# Altium schematic sheet P450_FJ_P_A_V2.3_F.SchDoc
size 508 x 304 mm
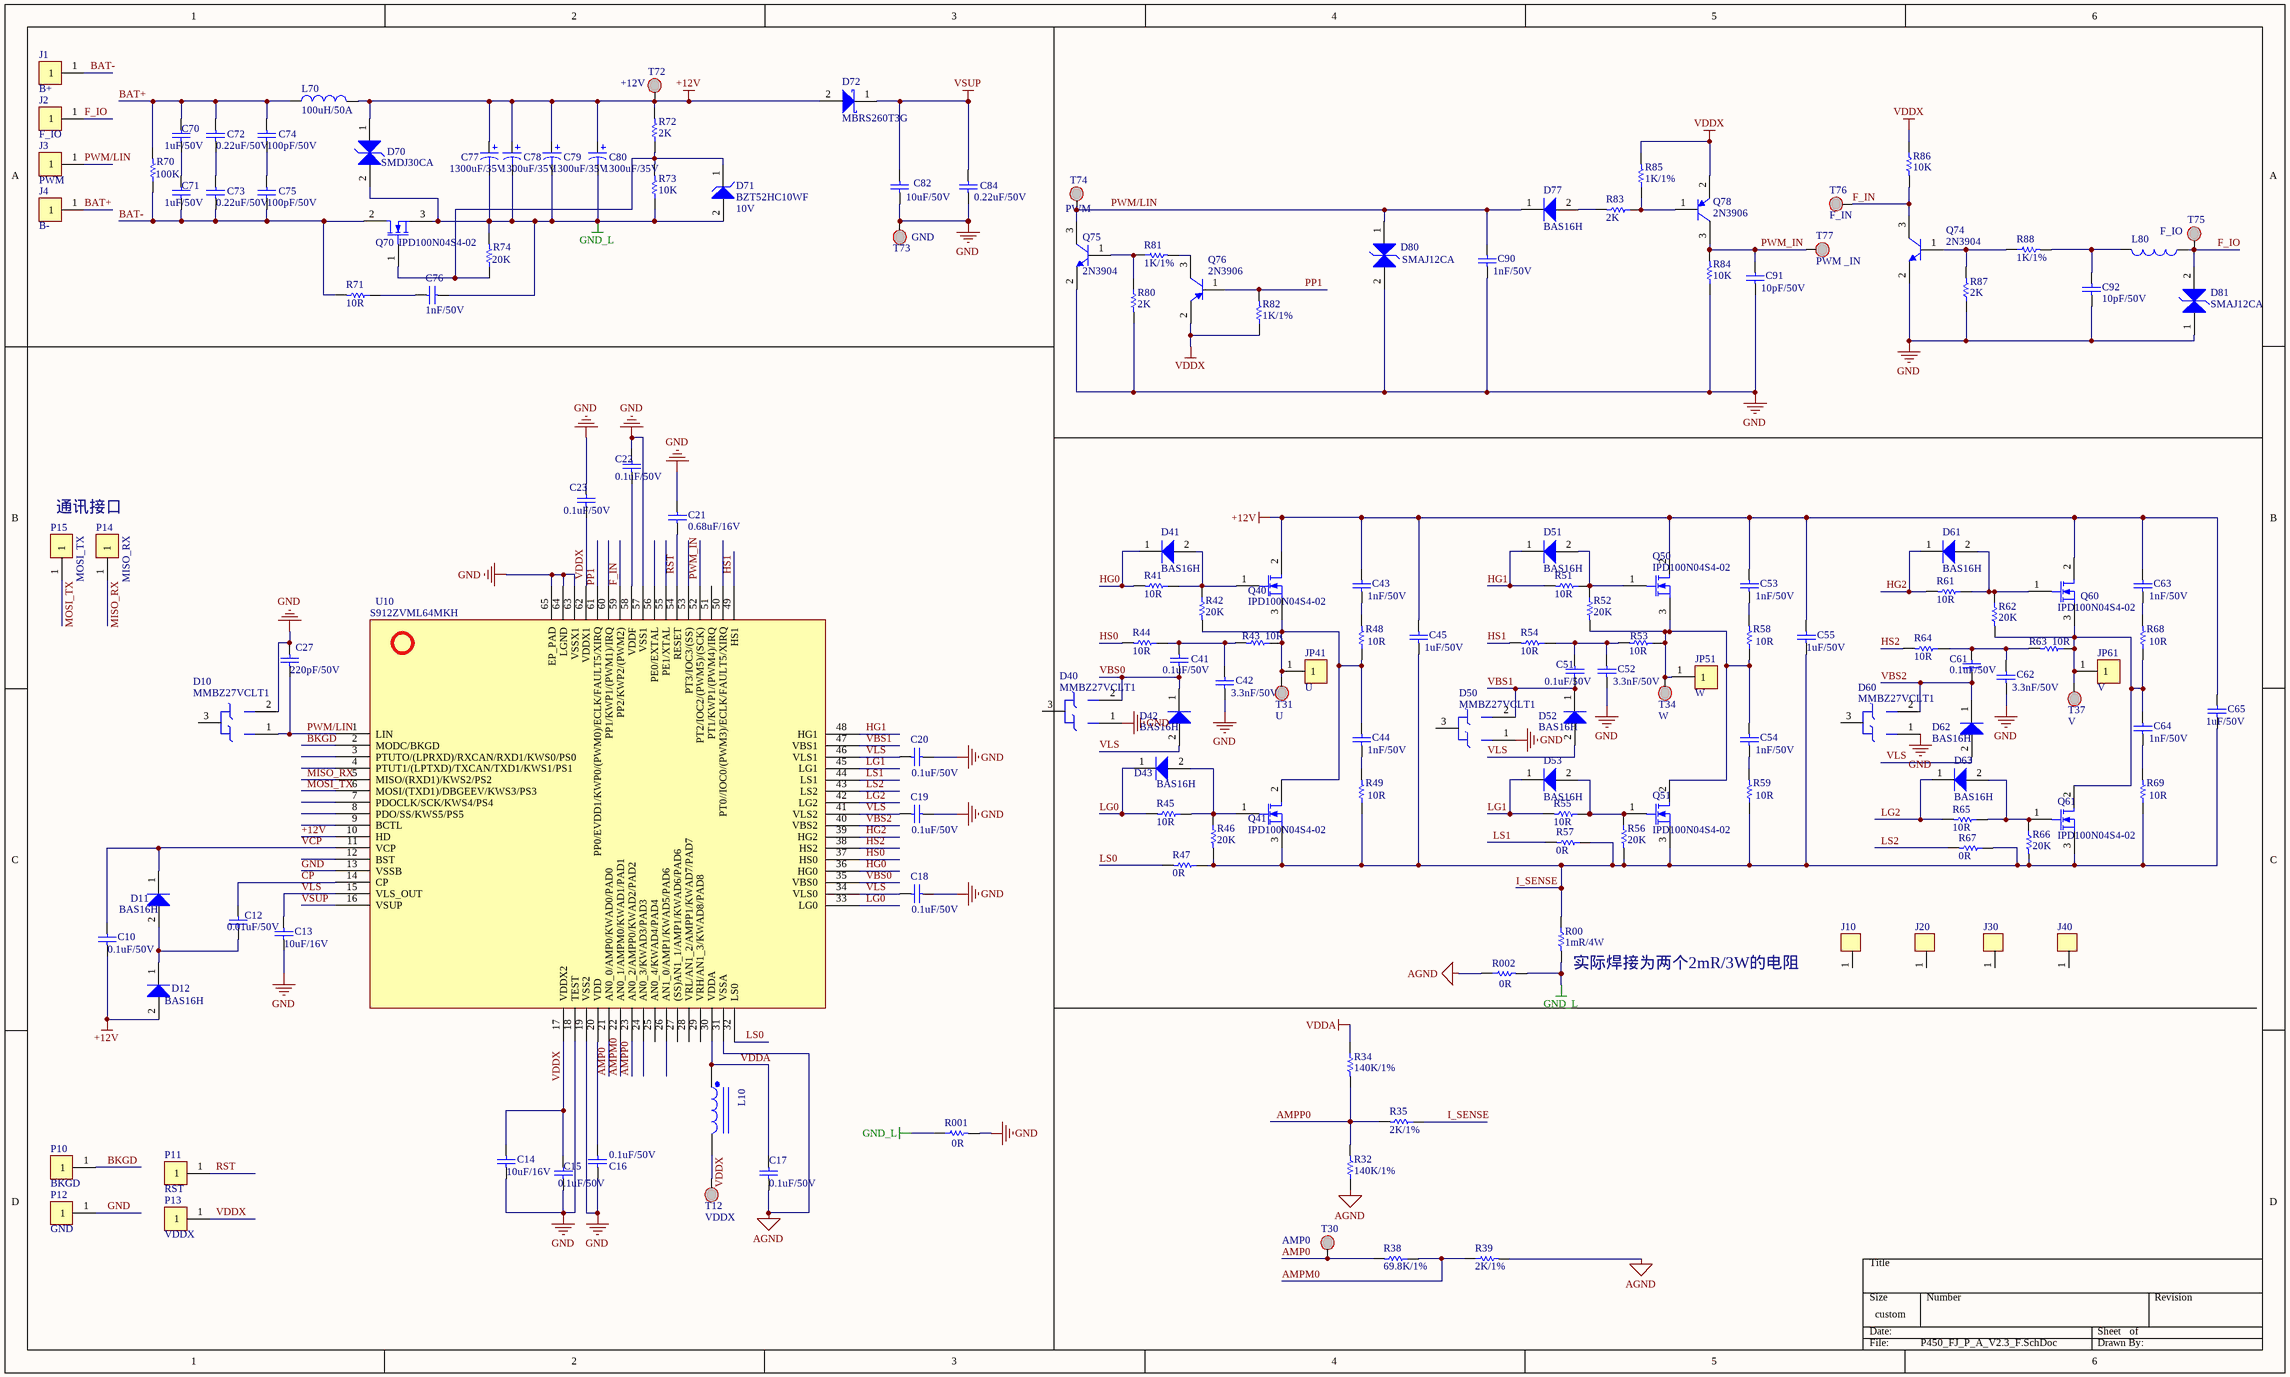
[diagram p0: P450_FJ_P_A_V2.3_F.SchDoc]

## Parts
C10  0.1uF/50V  [0603]
C12  0.01uF/50V  [0603]
C13  10uF/16V  [0805]
C14  10uF/16V  [0805]
C15  0.1uF/50V  [0603]
C16  0.1uF/50V  [0603]
C17  0.1uF/50V  [0603]
C18  0.1uF/50V  [0603]
C19  0.1uF/50V  [0603]
C20  0.1uF/50V  [0603]
C21  0.68uF/16V  [0603]
C22  0.1uF/50V  [0603]
C23  0.1uF/50V  [0603]
C27  220pF/50V  [0603]
C41  0.1uF/50V  [0603]
C42  3.3nF/50V  [0603]
C43  1nF/50V  [0603]
C44  1nF/50V  [0603]
C45  1uF/50V  [0805]
C51  0.1uF/50V  [0603]
C52  3.3nF/50V  [0603]
C53  1nF/50V  [0603]
C54  1nF/50V  [0603]
C55  1uF/50V  [0805]
C61  0.1uF/50V  [0603]
C62  3.3nF/50V  [0603]
C63  1nF/50V  [0603]
C64  1nF/50V  [0603]
C65  1uF/50V  [0805]
C70  1uF/50V  [0805]
C71  1uF/50V  [0805]
C72  0.22uF/50V  [0805]
C73  0.22uF/50V  [0805]
C74  100pF/50V  [0805]
C75  100pF/50V  [0805]
C76  1nF/50V  [0603]
C77  value 1300uF/35V  [RB5.0]  (hidden comment: EGPD350E__132MK20H)
C78  value 1300uF/35V  [RB5.0]  (hidden comment: EGPD350E__132MK20H)
C79  value 1300uF/35V  [RB5.0]  (hidden comment: EGPD350E__132MK20H)
C80  value 1300uF/35V  [RB5.0]  (hidden comment: EGPD350E__132MK20H)
C82  10uF/50V  [1210]
C84  0.22uF/50V  [0805]
C90  1nF/50V  [0603]
C91  10pF/50V  [0603]
C92  10pF/50V  [0603]
D10  MMBZ27VCLT1  [SOT-23T]
D11  BAS16H  [SOD323]
D12  BAS16H  [SOD323]
D40  MMBZ27VCLT1  [SOT-23T]
D41  BAS16H  [SOD323]
D42  BAS16H  [SOD323]
D43  BAS16H  [SOD323]
D50  MMBZ27VCLT1  [SOT-23T]
D51  BAS16H  [SOD323]
D52  BAS16H  [SOD323]
D53  BAS16H  [SOD323]
D60  MMBZ27VCLT1  [SOT-23T]
D61  BAS16H  [SOD323]
D62  BAS16H  [SOD323]
D63  BAS16H  [SOD323]
D70  SMDJ30CA  [DO-214AB]
D71  BZT52HC10WF  [SOD123]
D72  MBRS260T3G  [SMB403A-03]
D77  BAS16H  [SOD323]
D80  SMAJ12CA  [SMA/DO-214AC]
D81  SMAJ12CA  [SMA/DO-214AC]
J1  B+  [POWER]
J2  F_IO  [IO]
J3  PWM  [IO]
J4  B-  [POWER]
J10  M3  [PADS]  (value not drawn)
J20  M3  [PADS]  (value not drawn)
J30  M3  [PADS]  (value not drawn)
J40  M3  [PADS]  (value not drawn)
JP41  U  [UVW1]
JP51  W  [UVW1]
JP61  V  [UVW1]
L10  KMZ1608YHR102BTD  [0603]  (value not drawn)
L70  100uH/50A  [L10-20]
L80  KMZ1608YHR102BTD  [0603]  (value not drawn)
P10  BKGD  [TEST_S1]
P11  RST  [TEST_S1]
P12  GND  [TEST_S1]
P13  VDDX  [TEST_S2]
P14  MISO_RX  [TEST_S1]
P15  MOSI_TX  [TEST_S1]
Q40  IPD100N04S4-02  [TO-252]
Q41  IPD100N04S4-02  [TO-252]
Q50  IPD100N04S4-02  [TO-252]
Q51  IPD100N04S4-02  [TO-252]
Q60  IPD100N04S4-02  [TO-252]
Q61  IPD100N04S4-02  [TO-252]
Q70  IPD100N04S4-02  [TO-252]
Q74  2N3904  [SOT-23T]
Q75  2N3904  [SOT-23T]
Q76  2N3906  [SOT-23T]
Q78  2N3906  [SOT-23T]
R00  value 1mR/4W  [1050]  (hidden comment: LRS1050FEDHR001)
R001  0R  [0603]
R002  0R  [0603]
R32  140K/1%  [0603]
R34  140K/1%  [0603]
R35  2K/1%  [0603]
R38  69.8K/1%  [0603]
R39  2K/1%  [0603]
R41  10R  [0603]
R42  20K  [0603]
R43  10R  [0603]
R44  10R  [0603]
R45  10R  [0603]
R46  20K  [0603]
R47  0R  [0603]
R48  10R  [0603]
R49  10R  [0603]
R51  10R  [0603]
R52  20K  [0603]
R53  10R  [0603]
R54  10R  [0603]
R55  10R  [0603]
R56  20K  [0603]
R57  0R  [0603]
R58  10R  [0603]
R59  10R  [0603]
R61  10R  [0603]
R62  20K  [0603]
R63  10R  [0603]
R64  10R  [0603]
R65  10R  [0603]
R66  20K  [0603]
R67  0R  [0603]
R68  10R  [0603]
R69  10R  [0603]
R70  100K  [0805]
R71  10R  [0603]
R72  2K  [0603]
R73  10K  [0603]
R74  20K  [0603]
R80  2K  [0603]
R81  1K/1%  [0603]
R82  1K/1%  [0603]
R83  2K  [0603]
R84  10K  [0603]
R85  1K/1%  [0603]
R86  10K  [0603]
R87  2K  [0603]
R88  1K/1%  [0603]
T12  VDDX  [TEST_S]
T30  AMP0  [TEST-1]
T31  U  [TEST_S]
T34  W  [TEST_S]
T37  V  [TEST_S]
T72  +12V  [TEST_S]
T73  GND  [TEST_S]
T74  PWM  [TEST_S]
T75  F_IO  [TEST_S]
T76  F_IN  [TEST-1]
T77  PWM _IN  [TEST-1]
U10  S912ZVML64MKH  [64LQFP]

## Nets
+12V: C10.2 C43.2 C45.2 C53.2 C55.2 C63.2 C65.2 C77.1 C78.1 C79.1 C80.1 D12.2(A) D70.1 D72.2(A) L70.2 Q40.2(D) Q50.2(D) Q60.2(D) R72.2 T72.1 U10.10(HD)
AGND: C17.2 R002.1 R32.1 R39.2 U10.31(VSSA)
GND: C13.2 C14.2 C15.2 C16.1 C18.1 C19.1 C20.1 C21.2 C22.2 C23.1 C27.2 C42.1 C52.1 C62.1 C82.1 C84.1 C90.1 C91.2 C92.2 D10.2 D40.1 D50.1 D60.1 D80.2 D81.1 P12.1 Q74.2(E) Q75.2(E) R001.2 R80.2 R84.1 R87.1 T73.1 U10.13(VSSB) U10.18(TEST) U10.19(VSS2) U10.57(VSS1) U10.63(VSSX1) U10.64(LGND) U10.65(EP_PAD)
GND_L: C76.1 C77.2 C78.2 C79.2 C80.2 D70.2 D71.2(K) Q70.3(S) R00.2 R001.1 R002.2 R73.1 R74.2
VDDA: C17.1 L10.1 R34.1 U10.30(VDDA)
VDDX: C14.1 C15.1 C23.2 L10.2 P13.1 Q76.2(E) Q78.2(E) R82.1 R85.2 R86.1 T12.1 U10.17(VDDX2) U10.62(VDDX1)
VSUP: C82.2 C84.2 D72.1(C) U10.16(VSUP)
AMP0: R38.2 T30.1 U10.21(AN0_0/AMP0/KWAD0/PAD0)
AMPM0: R38.1 R39.1 U10.22(AN0_1/AMPM0/KWAD1/PAD1)
AMPP0: R32.2 R34.2 R35.2 U10.23(AN0_2/AMPP0/KWAD2/PAD2)
BAT+: C70.2 C72.2 C74.2 J4.1 L70.1 R70.2
BAT-: C71.1 C73.1 C75.1 J1.1 Q70.2(D) R70.1 R71.2
BKGD: P10.1 U10.2(MODC/BKGD)
CP: C12.2 U10.14(CP)
F_IN: Q74.3(C) R86.2 T76.1 U10.59(PP2/KWP2/(PWM2))
F_IO: D81.2 J2.1 L80.1 T75.1
HG0: D41.1(C) R41.2 U10.36(HG0)
HG1: D51.1(C) R51.2 U10.48(HG1)
HG2: D61.1(C) R61.2 U10.39(HG2)
HS0: R44.2 U10.37(HS0)
HS1: R54.2 U10.49(HS1)
HS2: R64.2 U10.38(HS2)
I_SENSE: C45.1 C55.1 C65.1 Q41.3(S) Q51.3(S) Q61.3(S) R00.1 R35.1 R46.2 R47.1 R49.1 R56.2 R57.1 R59.1 R66.2 R67.1 R69.1
LG0: D43.1(C) R45.2 U10.33(LG0)
LG1: D53.1(C) R55.2 U10.45(LG1)
LG2: D63.1(C) R65.2 U10.42(LG2)
LS0: R47.2 U10.32(LS0)
LS1: R57.2 U10.44(LS1)
LS2: R67.2 U10.43(LS2)
MISO_RX: P14.1 U10.5(MISO/(RXD1)/KWS2/PS2)
MOSI_TX: P15.1 U10.6(MOSI/(TXD1)/DBGEEV/KWS3/PS3)
PP1: Q76.1(B) R82.2 U10.61(PP0/EVDD1/KWP0/(PWM0)/ECLK/FAULT5/XIRQ)
PWM/LIN: C27.1 C90.2 D10.1 D77.1(C) D80.1 J3.1 Q75.3(C) T74.1 U10.1(LIN)
PWM_IN: C91.1 Q78.3(C) R84.2 T77.1 U10.52(PT2/IOC2/(PWM5)/(SCK))
RST: C21.1 P11.1 U10.54(RESET)
VBS0: C41.1 D40.2 D42.1(C) U10.35(VBS0)
VBS1: C51.1 D50.2 D52.1(C) U10.47(VBS1)
VBS2: C61.1 D60.2 D62.1(C) U10.40(VBS2)
VCP: C10.1 D11.1(C) U10.11(VCP)
VLS: C13.1 C18.2 C19.2 C20.2 D42.2(A) D52.2(A) D62.2(A) U10.15(VLS_OUT) U10.34(VLS0) U10.41(VLS2) U10.46(VLS1)
NetC12_1: C12.1 D11.2(A) D12.1(C)
NetC16_2: C16.2 U10.20(VDD)
NetC22_1: C22.1 U10.58(VDDF)
NetC41_2: C41.2 C42.2 R43.2 R44.1
NetC43_1: C43.1 R48.2
NetC44_1: C44.1 R49.2
NetC44_2: C44.2 JP41.1 Q40.3(S) Q41.2(D) R42.2 R43.1 R48.1 T31.1
NetC51_2: C51.2 C52.2 R53.2 R54.1
NetC53_1: C53.1 R58.2
NetC54_1: C54.1 R59.2
NetC54_2: C54.2 JP51.1 Q50.3(S) Q51.2(D) R52.2 R53.1 R58.1 T34.1
NetC61_2: C61.2 C62.2 R63.2 R64.1
NetC63_1: C63.1 R68.2
NetC64_1: C64.1 R69.2
NetC64_2: C64.2 JP61.1 Q60.3(S) Q61.2(D) R62.2 R63.1 R68.1 T37.1
NetC70_1: C70.1 C71.2
NetC72_1: C72.1 C73.2
NetC74_1: C74.1 C75.2
NetC76_2: C76.2 R71.1
NetC92_1: C92.1 L80.2 R88.2
NetD41_2: D41.2(A) Q40.1(G) R41.1 R42.1
NetD43_2: D43.2(A) Q41.1(G) R45.1 R46.1
NetD51_2: D51.2(A) Q50.1(G) R51.1 R52.1
NetD53_2: D53.2(A) Q51.1(G) R55.1 R56.1
NetD61_2: D61.2(A) Q60.1(G) R61.1 R62.1
NetD63_2: D63.2(A) Q61.1(G) R65.1 R66.1
NetD71_1: D71.1(A) Q70.1(G) R72.1 R73.2 R74.1
NetD77_2: D77.2(A) R83.2
NetQ74_1: Q74.1(B) R87.2 R88.1
NetQ75_1: Q75.1(B) R80.1 R81.1
NetQ76_3: Q76.3(C) R81.2
NetQ78_1: Q78.1(B) R83.1 R85.1

Not connected (* = marked no-connect by the designer): D10 3; D40 3; D50 3; D60 3; J10 1; J20 1; J30 1; J40 1; U10 3(PTUTO/(LPRXD)/RXCAN/RXD1/KWS0/PS0) 4(PTUT1/(LPTXD)/TXCAN/TXD1/KWS1/PS1) 7(PDOCLK/SCK/KWS4/PS4) 8(PDO/SS/KWS5/PS5) 9(BCTL) 12(BST) 24(AN0_3/KWAD3/PAD3) 25(AN0_4/KWAD4/PAD4) 26(AN1_0/AMP1/KWAD5/PAD6) 27((SS)AN1_1/AMP1/KWAD6/PAD6) 28(VRL/AN1_2/AMPP1/KWAD7/PAD7) 29(VRH/AN1_3/KWAD8/PAD8) 50(PT0//IOC0/(PWM3)/ECLK/FAULT5/XIRQ) 51(PT1/KWP1/(PWM4)/IRQ) 53(PT3/IOC3/(SS)) 55(PE1/XTAL) 56(PE0/EXTAL) 60(PP1/KWP1/(PWM1)/IRQ)

## Notes on the sheet
- 通讯接口
- (near R00) 实际焊接为两个2mR/3W的电阻
- (in symbol D Zener) 10V

## Library data of the parts
C10 C12-C23 C27 C41-C45 C51-C55 C61-C65 C70-C76 C82 C84 C90-C92 = Cap: Capacitor; Published: 8-Jun-2000; LatestRevisionDate: 17-Jul-2002; LatestRevisionNote: Re-released for DXP Platform.; PackageReference: RAD-0.3; Publisher: Altium Limited
  C10 C15-C20 C22 C23 C41 C51 C61: PackageDescription: Radial Cap, Thru-Hole; 2 Leads; 0.3 in Pin Spacing; Value: 0.1uF/50V
  C12: PackageDescription: Radial Cap, Thru-Hole; 2 Leads; 0.3 in Pin Spacing; Value: 0.01uF/50V
  C13 C14: PackageDescription: Radial Cap, Thru-Hole; 2 Leads; 0.3 in Pin Spacing; Value: 10uF/16V
  C21: PackageDescription: Radial Cap, Thru-Hole; 2 Leads; 0.3 in Pin Spacing; Value: 0.68uF/16V
  C27: PackageDescription: Radial Cap, Thru-Hole; 2 Leads; 0.3 in Pin Spacing; Value: 220pF/50V
  C42 C52 C62: PackageDescription: Radial Cap, Thru-Hole; 2 Leads; 0.3 in Pin Spacing; Value: 3.3nF/50V
  C43 C44 C53 C54 C63 C64 C90: Value: 1nF/50V
  C45 C55 C65 C70 C71: PackageDescription: Radial Cap, Thru-Hole; 2 Leads; 0.3 in Pin Spacing; Value: 1uF/50V
  C72 C73 C84: PackageDescription: Radial Cap, Thru-Hole; 2 Leads; 0.3 in Pin Spacing; Value: 0.22uF/50V
  C74 C75: PackageDescription: Radial Cap, Thru-Hole; 2 Leads; 0.3 in Pin Spacing; Value: 100pF/50V
  C76: PackageDescription: Radial Cap, Thru-Hole; 2 Leads; 0.3 in Pin Spacing; Value: 1nF/50V
  C82: PackageDescription: Radial Cap, Thru-Hole; 2 Leads; 0.3 in Pin Spacing; Value: 10uF/50V
  C91: Value: 10pF/50V
  C92: PackageDescription: Radial Cap, Thru-Hole; 2 Leads; 0.3 in Pin Spacing; Value: 10pF/50V
C77-C80 = Cap Pol1: Published: 8-Jun-2000; LatestRevisionDate: 17-Jul-2002; LatestRevisionNote: Re-released for DXP Platform.; PackageReference: RB7.6-15; Publisher: Altium Limited; PackageDescription: Polarized Capacitor (Radial); 2 Leads
D10 D40 D50 D60 = MMBZ27VCLT1: D_TVS
D11 D12 D41-D43 D51-D53 D61-D63 D77 = Diode: Default Diode; Published: 8-Jun-2000; LatestRevisionDate: 17-Jul-2002; LatestRevisionNote: Re-released for DXP Platform.; PackageVersion: Sep-1996; PackageReference: SMC; Publisher: Altium Limited; PackageDescription: DO-214-AB/SMC; 2 C-Bend Leads; Body 7.9 x 5.9 mm, inc. leads (LxW); Code_JEDEC: DO-214-AB
D70 D80 D81 = TVS_D: Tunnel Diode - RLC Model; Published: 8-Jun-2000; LatestRevisionDate: 17-Jul-2002; LatestRevisionNote: Re-released for DXP Platform.; PackageVersion: Feb-2002; PackageReference: 3.2X1.6X1.1; Publisher: Altium Limited; PackageDescription: SM LED; 2 Flat Leads
D71 = D Zener: Zener Diode; Published: 8-Jun-2000; LatestRevisionDate: 17-Jul-2002; LatestRevisionNote: Re-released for DXP Platform.; PackageReference: DIODE-0.7; Publisher: Altium Limited; PackageDescription: Diode, Thru-Hole; 2 Leads; 0.7 in Pin Spacing
D72 = Diode BAT17: Silicon RF Schottky Diode for Mixer Applications in the VHF/UHF Range; Note: Pin 2 is not connected and not drawn.; Published: 21-Mar-2003; LatestRevisionDate: 29-May-2009; LatestRevisionNote: IPC-7351 Footprint Added.; DatasheetVersion: Oct-1999; PackageVersion: Sep-2001; PackageReference: SOT-23; Publisher: Altium Limited; PackageDescription: 3-Pin SOT-23 Package 0.95 mm Pitch, 2.5 mm Lead Span; ComponentLink1Description: Manufacturer Link; ComponentLink1URL: http://www.infineon.com/; ComponentLink2Description: Datasheet; ComponentLink2URL: http://www.infineon.com/upload/Document/cmc_upload/documents/009/363/bat17series.pdf
J1-J4 = J1X1: Header
J10 J20 J30 J40 = CON1
JP41 JP51 JP61 = HDR 1X1: Header
L10 = Inductor Iron Dot: Magnetic-Core Inductor with Winding Polarity Marking; Published: 24-Mar-1999; LatestRevisionDate: 17-Jul-2002; LatestRevisionNote: Re-released for DXP Platform.; PackageReference: DIODE_SMC; Publisher: Altium Limited; PackageDescription: Diode; 2 Leads; Value: KMZ1608YHR102BTD
L70 = Inductor: AFDIGOQQQQ092R5MR1; Code_IEC: 1005; Published: 8-Jun-2000; LatestRevisionDate: 29-May-2009; LatestRevisionNote: IPC-7351 Footprint Added.; PackageReference: 0402-A; Publisher: Altium Limited; PackageDescription: Chip Inductor; Code_JEITA: 0402; Value: 100uH/50A
L80 = Inductor: Code_IEC: 1005; Published: 8-Jun-2000; LatestRevisionDate: 29-May-2009; LatestRevisionNote: IPC-7351 Footprint Added.; PackageReference: 0402-A; Publisher: Altium Limited; PackageDescription: Chip Inductor; Code_JEITA: 0402; Value: KMZ1608YHR102BTD
P10-P15 = Header1: Header
Q40 Q41 Q50 Q51 Q60 Q61 Q70 = MOSFET-N: N-Channel MOSFET; Published: 8-Jun-2000; LatestRevisionDate: 17-Jul-2002; LatestRevisionNote: Re-released for DXP Platform.; PackageVersion: 1995/1996; PackageReference: E3; Publisher: Altium Limited
Q74 Q75 = MMBTA06: NPN General Purpose Amplifier; Published: 8-Jun-2000; LatestRevisionDate: 15-Jan-2003; LatestRevisionNote: PCB Footprint 'BCY-W3/D4.7' replaced; DatasheetVersion: 1997; PackageVersion: Sep-1998; PackageReference: TO-92A; Publisher: Altium Limited; ComponentLink1Description: Manufacturer Link; ComponentLink1URL: http://www.fairchildsemi.com/; ComponentLink2Description: Datasheet; ComponentLink2URL: http://www.fairchildsemi.com/ds/2N%2F2N3904.pdf; PackageDescription: TO, Flat Index; 3 In-Line, Axial Leads; Body Dia. 4.5mm; Leads 0.51 x 0.48 mm (max)
Q76 Q78 = 2N3906: PNP General Purpose Amplifier; Published: 8-Jun-2000; LatestRevisionDate: 15-Jan-2003; LatestRevisionNote: PCB Footprint 'BCY-W3/D4.7' replaced; DatasheetVersion: 1997; PackageVersion: Sep-1998; PackageReference: TO-92A; Publisher: Altium Limited; PackageDescription: TO, Flat Index; 3 In-Line, Axial Leads; Body Dia. 4.5mm; Leads 0.51 x 0.48 mm (max); ComponentLink1Description: Manufacturer Link; ComponentLink1URL: http://www.fairchildsemi.com/; ComponentLink2Description: Datasheet; ComponentLink2URL: http://www.fairchildsemi.com/ds/2N%2F2N3906.pdf
R00 R001 R002 R32 R34 R35 R38 R39 R41-R49 R51-R59 R61-R74 R80-R88 = Res1: Resistor; Published: 8-Jun-2000; LatestRevisionDate: 17-Jul-2002; LatestRevisionNote: Re-released for DXP Platform.; PackageReference: AXIAL-0.3; Publisher: Altium Limited
  R00: PackageDescription: Axial Device, Thru-Hole; 2 Leads; 0.3 in Pin Spacing
  R001 R002: Value: 0R
  R32 R34: PackageDescription: Axial Device, Thru-Hole; 2 Leads; 0.3 in Pin Spacing; Value: 140K/1%
  R35 R39: PackageDescription: Axial Device, Thru-Hole; 2 Leads; 0.3 in Pin Spacing; Value: 2K/1%
  R38: PackageDescription: Axial Device, Thru-Hole; 2 Leads; 0.3 in Pin Spacing; Value: 69.8K/1%
  R41 R43-R45 R51 R53-R55 R61 R63-R65 R71: PackageDescription: Axial Device, Thru-Hole; 2 Leads; 0.3 in Pin Spacing; Value: 10R
  R42 R46 R52 R56 R62 R66 R74: PackageDescription: Axial Device, Thru-Hole; 2 Leads; 0.3 in Pin Spacing; Value: 20K
  R47 R57 R67: PackageDescription: Axial Device, Thru-Hole; 2 Leads; 0.3 in Pin Spacing; Value: 0R
  R48 R49 R58 R59 R68 R69: Value: 10R
  R70: PackageDescription: Axial Device, Thru-Hole; 2 Leads; 0.3 in Pin Spacing; Value: 100K
  R72 R87: PackageDescription: Axial Device, Thru-Hole; 2 Leads; 0.3 in Pin Spacing; Value: 2K
  R73 R86: PackageDescription: Axial Device, Thru-Hole; 2 Leads; 0.3 in Pin Spacing; Value: 10K
  R80 R83: Value: 2K
  R81 R82 R85: Value: 1K/1%
  R84: Value: 10K
  R88: PackageDescription: Axial Device, Thru-Hole; 2 Leads; 0.3 in Pin Spacing; Value: 1K/1%
T12 T30 T31 T34 T37 T72-T77 = TEST
U10 = PC9S12ZVML12MKH_1: MCU